# Altium schematic sheet buck.SchDoc: Convertisseur Buck Iteration #1
size A4; SheetNumber: 1
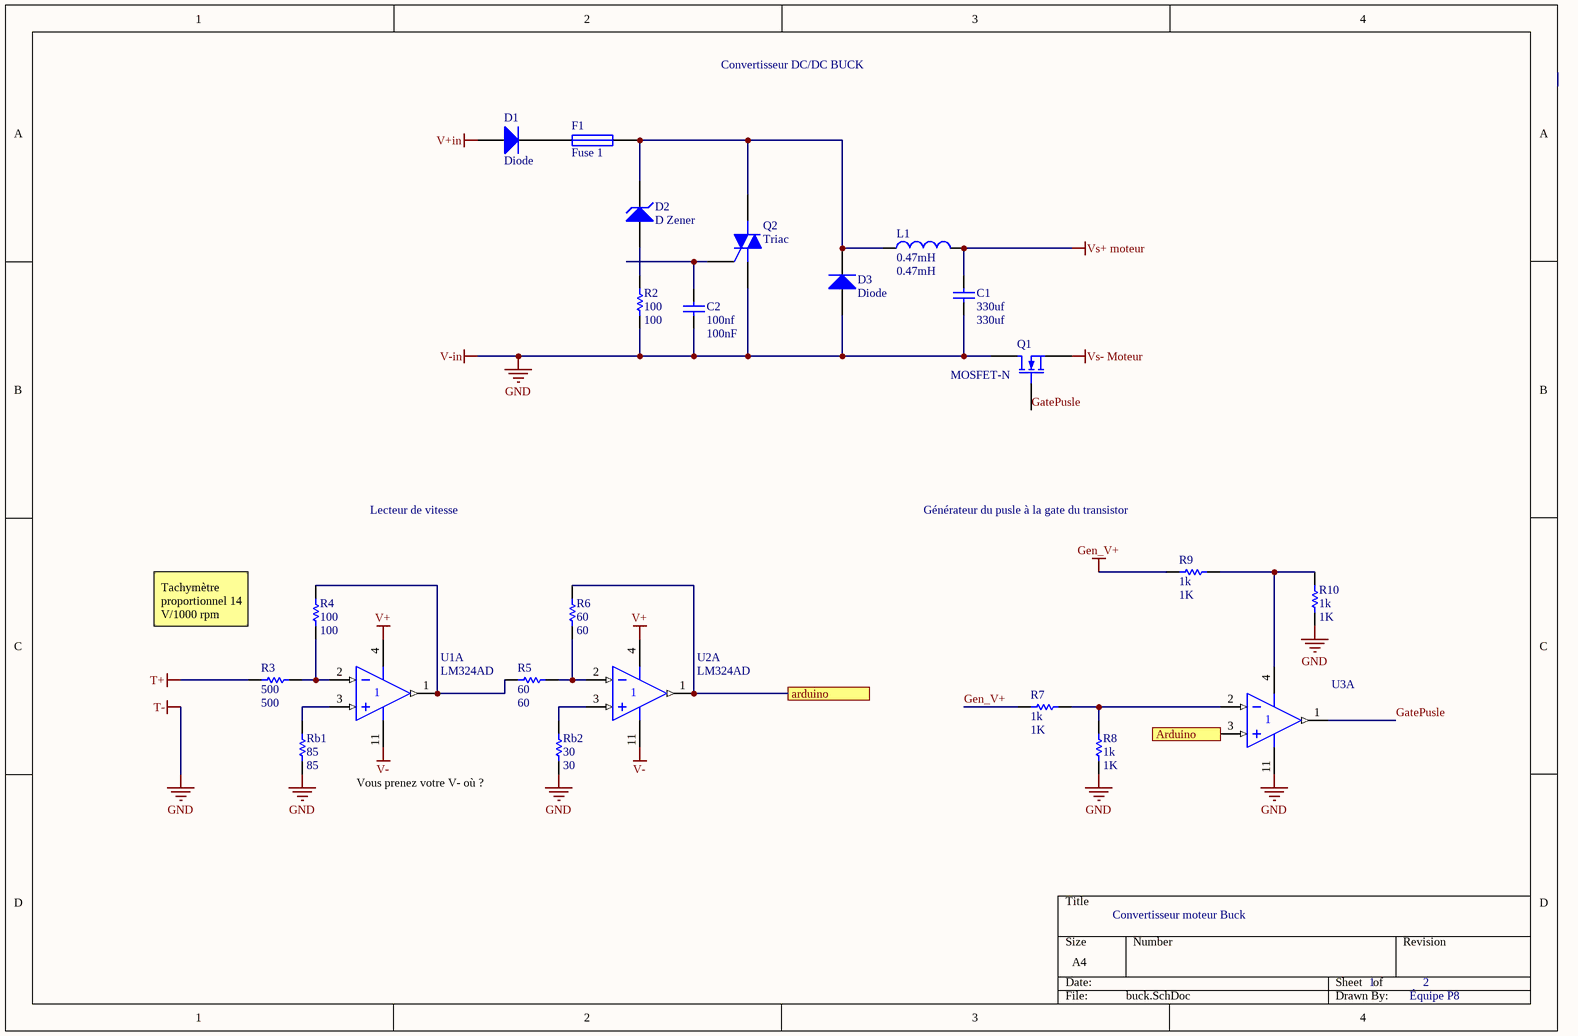
[diagram p0: buck.SchDoc]

## Parts
C1  330uf  [RAD-0.3]
C2  100nf  [RAD-0.3]
D1  Diode  [SMC]
D2  D Zener  [DIODE-0.7]
D3  Diode  [SMC]
F1  Fuse 1  [PIN-W2/E2.8]
L1  0.47mH  [0402-A]
Q1  MOSFET-N  [E3]
Q2  Triac  [369-03]
R2  100  [AXIAL-0.3]
R3  500  [AXIAL-0.3]
R4  100  [AXIAL-0.3]
R5  60  [AXIAL-0.3]
R6  60  [AXIAL-0.3]
R7  1k  [AXIAL-0.3]
R8  1k  [AXIAL-0.3]
R9  1k  [AXIAL-0.3]
R10  1k  [AXIAL-0.3]
Rb1  85  [AXIAL-0.3]
Rb2  30  [AXIAL-0.3]
U1  LM324AD  [D014_N]  (part A of 4)
U2  LM324AD  [D014_N]  (part A of 4)
U3  (no value)  [D014_N]  (part A of 4)

## Ports
arduino, Arduino

## Nets
Gen_V+: R7.1 R9.1
GND: C1.1 C2.1 D3.1(A) Q1.1(D) Q2.1(M1) R2.1 R8.1 R10.1 Rb1.1 Rb2.1 U3.11(V-)  [also labelled T-, V-in]
T+: R3.1
V+: U1.4(V+) U2.4(V+)
V+in: D1.1(A)
V-: U1.11(V-) U2.11(V-)
Vs+ moteur: C1.2 L1.2
Vs- Moteur: Q1.3(S)
arduino: R6.2 U2.1(OUT) U3.3(IN+) ; port arduino, port Arduino
GatePusle: Q1.2(G) U3.1(OUT)
NetC2_2: C2.2 Q2.3(G)
NetD1_2: D1.2(K) F1.1
NetD2_1: D2.1(A) R2.2
NetD2_2: D2.2(K) D3.2(K) F1.2 L1.1 Q2.2(M2)
NetR3_2: R3.2 R4.1 U1.2(IN-)
NetR4_2: R4.2 R5.1 U1.1(OUT)
NetR5_2: R5.2 R6.1 U2.2(IN-)
NetR7_2: R7.2 R8.2 U3.2(IN-)
NetR9_2: R9.2 R10.2 U3.4(V+)
NetRb1_2: Rb1.2 U1.3(IN+)
NetRb2_2: Rb2.2 U2.3(IN+)

## Notes on the sheet
- Convertisseur DC/DC BUCK
- Lecteur de vitesse
- Générateur du pusle à la gate du transistor
- Tachymètre proportionnel 14 V/1000 rpm
- Vous prenez votre V- où ?
- Convertisseur moteur Buck
- 1
- 2
- Équipe P8

## Library data of the parts
C1 C2 = Cap: Capacitor; Published: 8-Jun-2000; LatestRevisionDate: 17-Jul-2002; LatestRevisionNote: Re-released for DXP Platform.; PackageReference: RAD-0.3; Publisher: Altium Limited; PackageDescription: Radial Cap, Thru-Hole; 2 Leads; 0.3 in Pin Spacing
  C1: Value: 330uf
  C2: Value: 100nF
D1 D3 = Diode: Default Diode; Published: 8-Jun-2000; LatestRevisionDate: 17-Jul-2002; LatestRevisionNote: Re-released for DXP Platform.; PackageVersion: Sep-1996; PackageReference: SMC; Publisher: Altium Limited; PackageDescription: DO-214-AB/SMC; 2 C-Bend Leads; Body 7.9 x 5.9 mm, inc. leads (LxW); Code_JEDEC: DO-214-AB
D2 = D Zener: Zener Diode; Published: 8-Jun-2000; LatestRevisionDate: 17-Jul-2002; LatestRevisionNote: Re-released for DXP Platform.; PackageReference: DIODE-0.7; Publisher: Altium Limited; PackageDescription: Diode, Thru-Hole; 2 Leads; 0.7 in Pin Spacing
F1 = Fuse 1: Fuse; Published: 8-Jun-2000; LatestRevisionDate: 17-Jul-2002; LatestRevisionNote: Re-released for DXP Platform.; PackageReference: PIN-W2/E2.8; Publisher: Altium Limited; PackageDescription: Thru-Hole; 2 Leads
L1 = Inductor: Code_IEC: 1005; Published: 8-Jun-2000; LatestRevisionDate: 29-May-2009; LatestRevisionNote: IPC-7351 Footprint Added.; PackageReference: 0402-A; Publisher: Altium Limited; PackageDescription: Chip Inductor; Code_JEITA: 0402; Value: 0.47mH
Q1 = MOSFET-N: N-Channel MOSFET; Published: 8-Jun-2000; LatestRevisionDate: 17-Jul-2002; LatestRevisionNote: Re-released for DXP Platform.; PackageVersion: 1995/1996; PackageReference: E3; Publisher: Altium Limited; PackageDescription: TO, Flat Index; 3 In-Line, Axial Leads; Body Dia. 4.6mm; Lead Dia. 0.5 mm (max)
Q2 = Triac: Silicon Bidirectional Triode Thyristor; Note: Pin 2 is electrically connected to Pin 4 (TAB); Published: 29-Sep-2000; LatestRevisionDate: 17-Jul-2002; LatestRevisionNote: Re-released for DXP Platform.; DatasheetVersion: 1999; PackageReference: 369-03; Publisher: Altium Limited; PackageDescription: TO, Thru-Hole, Vertical, Heatsink Mounted; 3 In-Line Leads; Pitch 2.28 mm; ComponentLink1Description: Manufacturer Link; ComponentLink1URL: http://www.motorola.com/
R2-R10 Rb1 Rb2 = Res1: Resistor; Published: 8-Jun-2000; LatestRevisionDate: 17-Jul-2002; LatestRevisionNote: Re-released for DXP Platform.; PackageReference: AXIAL-0.3; Publisher: Altium Limited; PackageDescription: Axial Device, Thru-Hole; 2 Leads; 0.3 in Pin Spacing
  R2 R4: Value: 100
  R3: Value: 500
  R5 R6: Value: 60
  R7-R10: Value: 1K
  Rb1: Value: 85
  Rb2: Value: 30
U1-U3 = LM324AD: Quadruple Operational Amplifier; Published: 15-Apr-2002; LatestRevisionDate: 13-Apr-2006; LatestRevisionNote: IPC-7351 Footprint Added.; DatasheetVersion: Jan-1989; PackageVersion: Jan-1998; PackageReference: D014; Publisher: Altium Limited; PackageDescription: 14-Pin Small Outline Integrated Circuit 1.27 mm Pitch; Code_IPC: SOIC127P600-14; ComponentLink1Description: Manufacturer Link; ComponentLink1URL: http://www.ti.com/; ComponentLink2Description: Datasheet; ComponentLink2URL: http://www-s.ti.com/sc/ds/lm324.pdf